# Altium schematic sheet Pot.SchDoc
size A; Organization: Smart Product Design Lab; Address1: 201 Thornton; Address2: Stanford University; Address3: Stanford, CA; Address4: 94305-4021
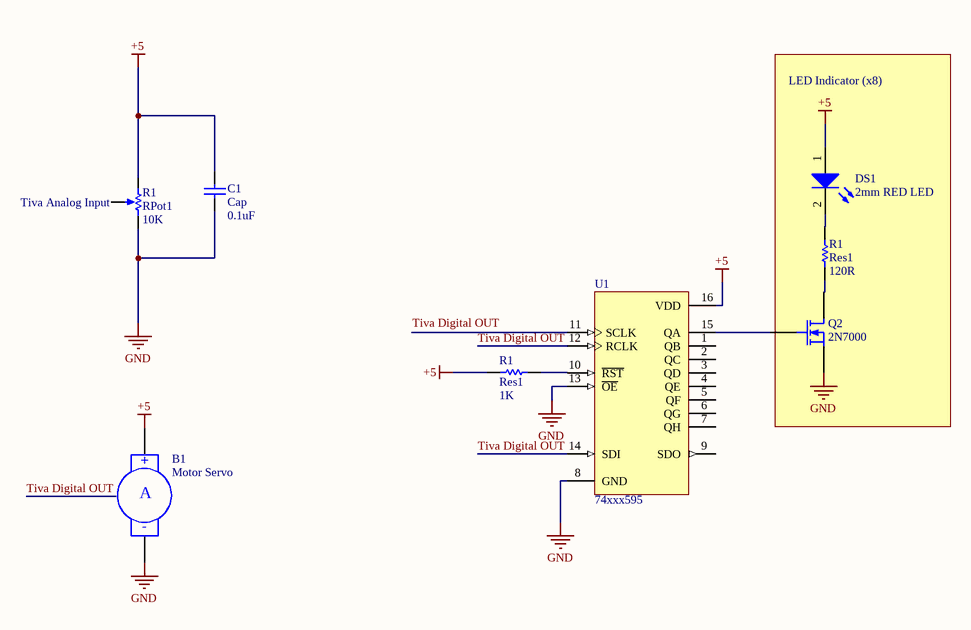
[diagram p0: Pot.SchDoc]

## Parts
(Parts that share a designator on the sheet are numbered #1, #2 ... from top to bottom, then left to right.)
B1  Motor Servo  [RAD-0.4]
C1  Cap  value 0.1uF  [RAD-0.3]
DS1  2mm RED LED  [LED-1]
Q2  2N7000  [BCY-W3/D5]
R1#1  RPot1  value 10K  [VR5]
R1#2  Res1  value 120R  [AXIAL-0.3]
R1#3  Res1  value 1K  [AXIAL-0.3]
U1  74xxx595  [DIP-16/X1.5]

## Blocks framed on the sheet
LED Indicator (x8): DS1 Q2 R1#2

## Nets
+5: B1.1(+) C1.2 DS1.1(A) R1#1.1(TOP) R1#3.1 U1.16(VDD)
GND: B1.2(-) C1.1 Q2.1(S) R1#1.2(BOT) U1.8(GND) U1.13(~{OE})
Tiva Digital OUT: U1.12(RCLK) U1.14(SDI)
NetDS1_2: DS1.2(K) R1#2.2
NetQ2_2: Q2.2(G) U1.15(QA)
NetQ2_3: Q2.3(D) R1#2.1
NetR1#3_2: R1#3.2 U1.10(~{RST})

Not connected (* = marked no-connect by the designer): R1#1 3(TAP); U1 1(QB) 2(QC) 3(QD) 4(QE) 5(QF) 6(QG) 7(QH) 9(SDO) 11(SCLK)

## Notes on the sheet
- (near R1#1) Tiva Analog Input
- Labels drawn without touching a wire or pin: Tiva Digital OUT
- Title
- Size:
- Date:
- File:
- A
- Number:
- Time:
- Revision:
- Sheet
- of
- Drawn By:
- (in symbol Motor Servo) A

## Library data of the parts
B1 = Motor Servo: Servo Motor; Manufacturer: Generic Components; Published: 1999
C1 = Cap: Capacitor; Manufacturer: Generic Components; Class: Passive; Published: 08/06/2000; Publisher: Altium Hobart Technology Centre; SubClass: Capacitor
DS1 = LED1: Typical RED GaAs LED; Manufacturer: Generic Components; Class: Optoelectronic; Published: 08/06/2000; Publisher: Altium Hobart Technology Centre; SubClass: LED
Q2 = 2N7000: N-Channel Enhancement Mode Vertical DMOS FET; Manufacturer: Zetex; Class: Discrete; SubClass: MOSFET - Low Power; Published: 8/06/2000; Publisher: Altium Hobart Technology Centre
R1#1 = RPot1: Potentiometer; Manufacturer: Generic Components; Class: Passive; Set Position: 0.5; Published: 08/06/2000; Publisher: Altium Hobart Technology Centre; SubClass: Potentiometer
R1#2 R1#3 = Res1: Resistor; Manufacturer: Generic Components; Class: Passive; Published: 08/06/2000; Publisher: Altium Hobart Technology Centre; SubClass: Resistor
U1 = 74xxx595: 8-Bit Serial-Input/Serial or Prallel-Output Shift Register with Latched 3-State Outputs; Manufacturer: ON Semiconductor; Class: Logic; Published: 15/04/2002; Publisher: Altium Hobart Technology Centre; SubClass: Register